# EAGLE design 4-SSR (EAGLE 7.7.0)
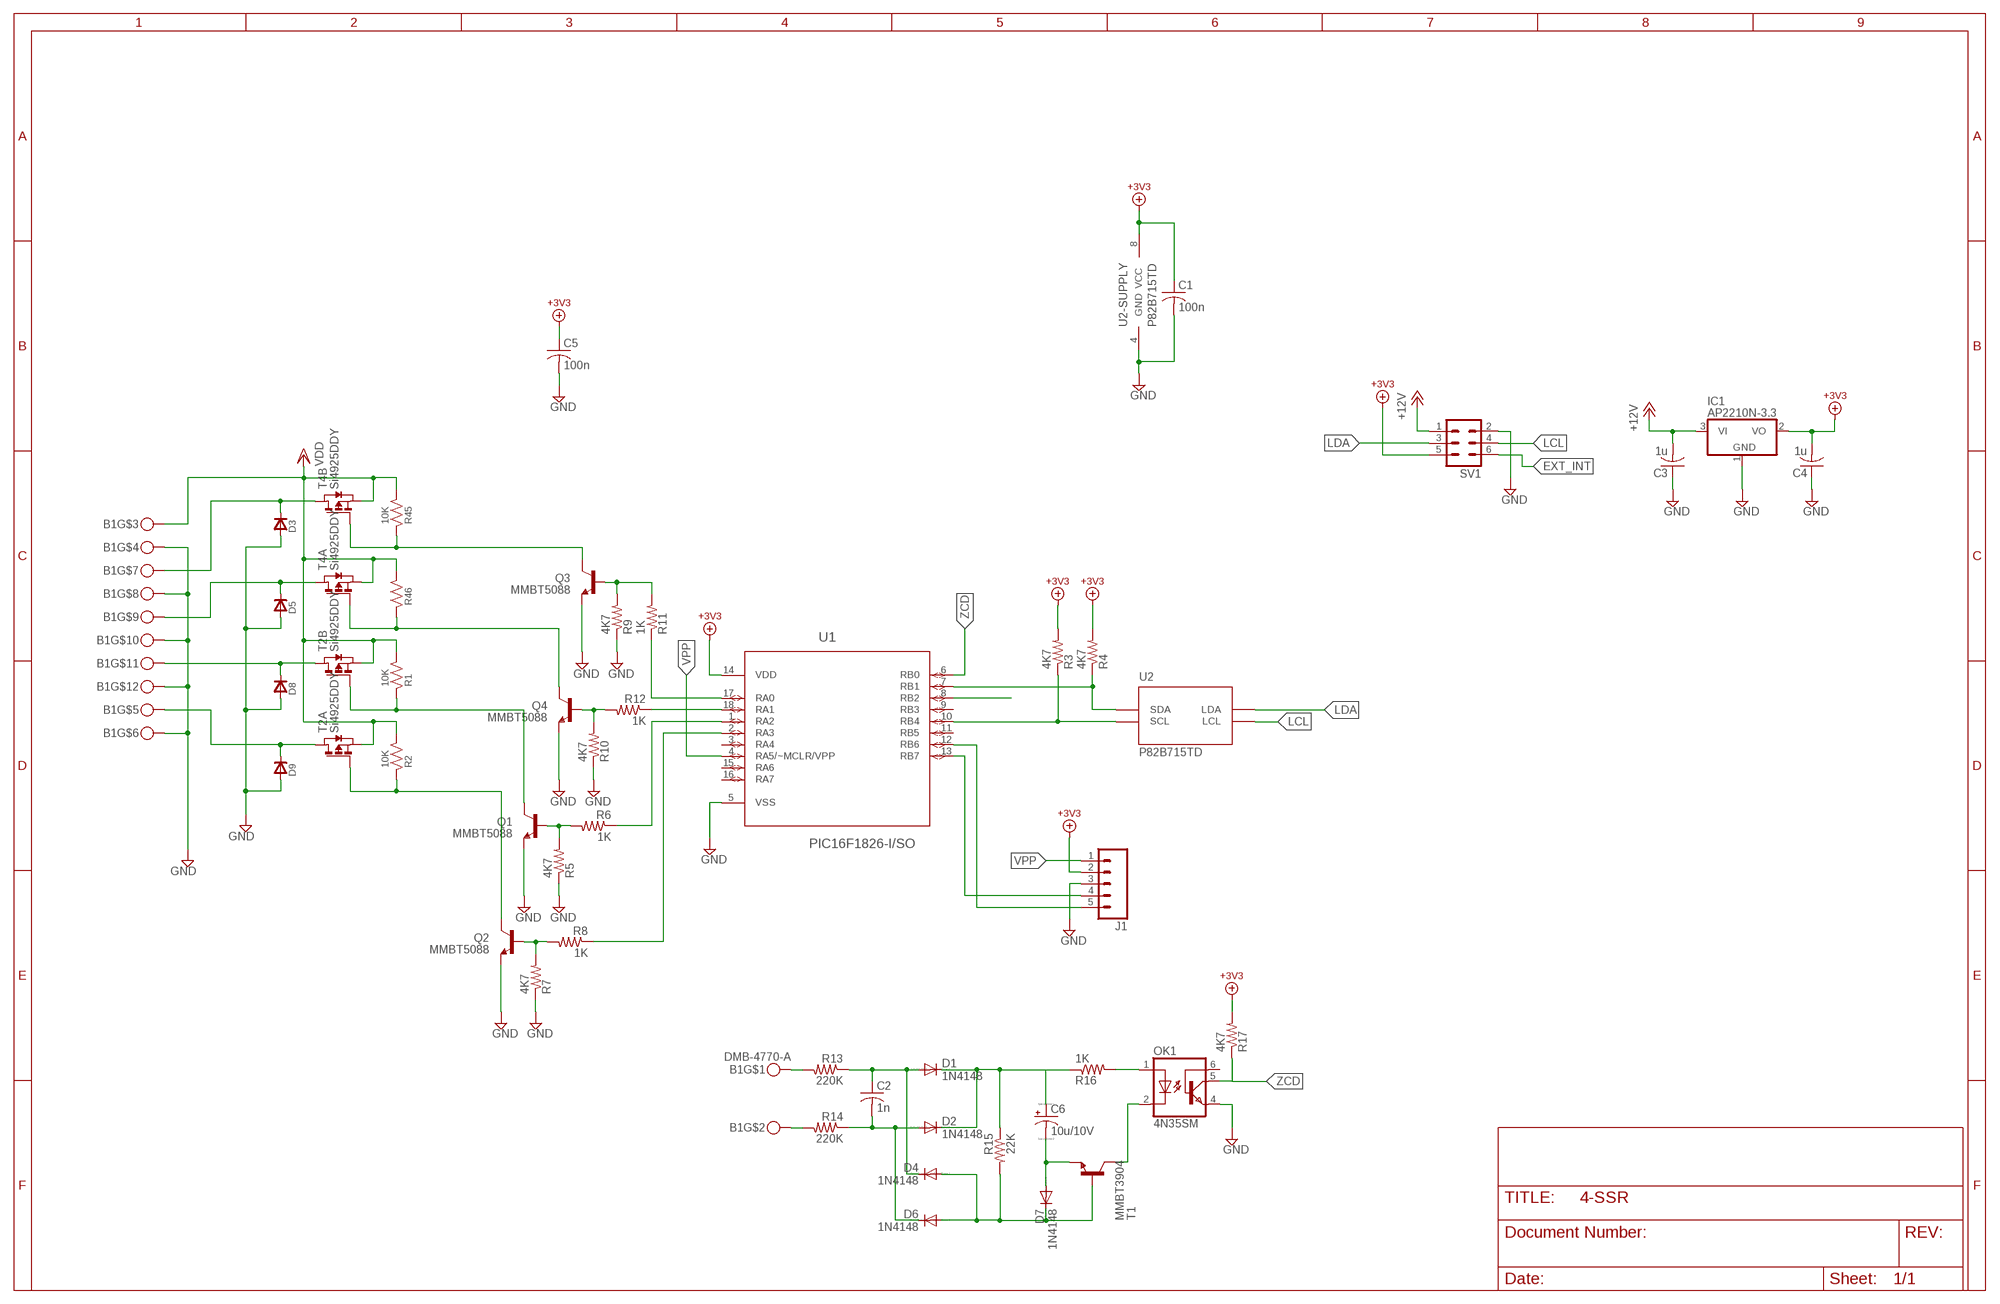
[diagram p0: schematic, sheet 1]

## Parts
B1  DMB-4770-A  [DMB-4770-A-PKG]
C1  100n  C-USC0805  [C0805]
C2  1n  C-USC1808  [C1808]
C3  1u  C-USC0805  [C0805]
C4  1u  C-USC0805  [C0805]
C5  100n  C-USC0805  [C0805]
C6  10u/10V  CPOL-USB  [PANASONIC_B]
D1  1N4148  DIODE-SOD80C  [SOD80C]
D2  1N4148  DIODE-SOD80C  [SOD80C]
D3  DSMA  [DSMA]
D4  1N4148  DIODE-SOD80C  [SOD80C]
D5  DSMA  [DSMA]
D6  1N4148  DIODE-SOD80C  [SOD80C]
D7  1N4148  DIODE-SOD80C  [SOD80C]
D8  DSMA  [DSMA]
D9  DSMA  [DSMA]
IC1  AP2210N-3.3  MCP1703CB  [SOT23]
J1  M05PTH  [1X05]
OK1  4N35SM  [DIL6-SMD]
Q1  MMBT5088  TRANSISTOR_NPNMMBT5088  [SOT23-3]
Q2  MMBT5088  TRANSISTOR_NPNMMBT5088  [SOT23-3]
Q3  MMBT5088  TRANSISTOR_NPNMMBT5088  [SOT23-3]
Q4  MMBT5088  TRANSISTOR_NPNMMBT5088  [SOT23-3]
R1  10K  RU0805  [R0805]
R2  10K  RU0805  [R0805]
R3  4K7  R-US_R0805  [R0805]
R4  4K7  R-US_R0805  [R0805]
R5  4K7  R-US_R0805  [R0805]
R6  1K  R-US_R0805  [R0805]
R7  4K7  R-US_R0805  [R0805]
R8  1K  R-US_R0805  [R0805]
R9  4K7  R-US_R0805  [R0805]
R10  4K7  R-US_R0805  [R0805]
R11  1K  R-US_R0805  [R0805]
R12  1K  R-US_R0805  [R0805]
R13  220K  R-US_R0805  [R0805]
R14  220K  R-US_R0805  [R0805]
R15  22K  R-US_R0805  [R0805]
R16  1K  R-US_R0805  [R0805]
R17  4K7  R-US_R0805  [R0805]
R45  10K  RU0805  [R0805]
R46  RU0805  [R0805]
SV1  ML6  [ML6]
T1  MMBT3904  MMBT3904LT1-NPN-SOT23-BEC  [SOT23-BEC]
T2  Si4925DDY  PMOS2SO8  [SO8]
T4  Si4925DDY  PMOS2SO8  [SO8]
U1  PIC16F1826-I/SO  [SOIC127P1030X175-18N]
U2  P82B715TD  [SOIC-8]

## Nets
+3V3: C1.1 C4.2 C5.1 IC1.2(VO) J1.2 R3.2 R4.2 R17.2 SV1.5 U1.14(VDD) U2.8(VCC) ; supply symbol labelled V+3V3
+12VBUS: C3.2 IC1.3(VI) SV1.1 ; supply symbol labelled +12V
EXT_INT: SV1.6
GND: B1.P$4 B1.P$6 B1.P$8 B1.P$10 B1.P$12 C1.2 C3.1 C4.1 C5.2 D3.A D5.A D8.A D9.A IC1.1(GND) J1.3 OK1.4(EMI) Q1.2(E) Q2.2(E) Q3.2(E) Q4.2(E) R5.1 R7.1 R9.1 R10.1 SV1.2 U1.5(VSS) U2.4(GND)
LCL: SV1.4 U2.2(LCL)
LDA: SV1.3 U2.7(LDA)
N$1: Q1.3(C) R1.1 T2.4(B:G)
N$2: B1.P$11 D8.C T2.5(B:D) T2.6(B:D)
N$3: Q2.3(C) R2.1 T2.2(A:G)
N$4: B1.P$5 D9.C T2.7(A:D) T2.8(A:D)
N$5: J1.4 U1.13(RB7)
N$6: J1.5 U1.12(RB6)
N$7: R12.1 U1.18(RA1)
N$9: U1.8(RB2)
N$10: Q4.3(C) R46.1 T4.2(A:G)
N$11: Q3.1(B) R9.2 R11.2
N$12: R11.1 U1.17(RA0)
N$13: Q1.1(B) R5.2 R6.2
N$14: Q4.1(B) R10.2 R12.2
N$15: B1.P$1 R13.2
N$16: B1.P$2 R14.2
N$17: C2.1 D1.A D4.C R13.1
N$18: C2.2 D2.A D6.C R14.1
N$19: C6.+ D1.C D2.C R15.1 R16.1
N$20: C6.- D7.A T1.E
N$21: OK1.1(A) R16.2
N$22: D4.A D6.A D7.C R15.2 T1.B
N$23: OK1.2(C) T1.C
N$24: R6.1 U1.1(RA2)
N$26: Q2.1(B) R7.2 R8.2
N$27: R8.1 U1.2(RA3)
N$41: R3.1 U1.10(RB4) U2.3(SCL)
N$42: R4.1 U1.7(RB1) U2.6(SDA)
N$80: Q3.3(C) R45.1 T4.4(B:G)
N$95: B1.P$7 D3.C T4.5(B:D) T4.6(B:D)
N$96: B1.P$9 D5.C T4.7(A:D) T4.8(A:D)
VDD: B1.P$3 R1.2 R2.2 R45.2 R46.2 T2.1(A:S) T2.3(B:S) T4.1(A:S) T4.3(B:S)
VPP: J1.1 U1.4(RA5/~MCLR/VPP)
ZCD: OK1.5(COL) R17.1 U1.6(RB0)
Unconnected: OK1.6(BAS) U1.3(RA4) U1.9(RB3) U1.11(RB5) U1.15(RA6) U1.16(RA7)

## Library data of the parts
B1 = Cedric:DMB-4770-A
C1-C5 = resistor:C-US: CAPACITOR, American symbol
C6 = resistor:CPOL-US: POLARIZED CAPACITOR, American symbol
D1 D2 D4 D6 D7 = diode:DIODE-: DIODE
D3 D5 D8 D9 = diodes:D: Diode
IC1 = linear:MCP1703: 250 mA, 16V, Low Quiescent Current LDO Regulator Source: http://ww1.microchip.com/downloads/en/DeviceDoc/22049b.pdf
J1 = SparkFun-Connectors:M05: Header 5 Standard 5-pin 0.1" header. Use with straight break away headers (SKU : PRT-00116), right angle break away headers (PRT-00553), swiss pins (PRT-00743), machine pins (PRT-00117), and female headers (PRT-00115). Molex polarized connector foot print use with SKU : PRT-08230 with associated crimp pins and housings.
OK1 = optocoupler:4N*?M: General Purpose 6-Pin Phototransistor Optocouplers Source: http://www.fairchildsemi.com/ds/4N/4N35-M.pdf; MF: FAIRCHILD SEMICONDUCTOR; MPN: 4N35S-M; OC_FARNELL: 1021179; OC_NEWARK: 67K2285
Q1-Q4 = SparkFun-DiscreteSemi:TRANSISTOR_NPN: Generic NPN BJT MMBT2222A - TRANS-08049 (SOT-23, 1A 40V) MPSA42 - TRANS-09116 (SOT-23, 500mA 300V) MMBT5088LT1G - TRANS-11160 (SOT-23, 50 mA 30V) BC547 - COM-08928 <http://www.sparkfun.com/products/8928> (TO-92 45V 100mA) (1.Collector 2.Base 3.Emitter) 2N3904 - COM-00521 <http://www.sparkfun.com/products/521> (TO-92 40V 200mA) (1.Emitter 2.Base 3.Collector) P2N2222A - COM-12852 <http://www.sparkfun.com/products/12852> (TO-92 40V 600mA) (1.Collector 2.Base 3.Emitter); PROD_ID: TRANS-11160
R1 R2 R45 R46 = divers:RU: Resistor, US symbol
R3-R12 R17 = resistor:R-US_: RESISTOR, American symbol
R13-R16 = rcl:R-US_: RESISTOR, American symbol
SV1 = con-harting-ml:ML6: HARTING; OC_FARNELL: unknown; OC_NEWARK: unknown
T1 = transistor:*-NPN-: NPN Transistror BF959 corrected 2008.03.06
T2 T4 = zetex:PMOS2: DUAL 30V P-CHANNEL ENHANCEMENT MODE MOSFET Source: Data sheet <http://www.diodes.com/datasheets/ZXMP3A16DN8.pdf> SOP8 Source: Data sheet <http://www.diodes.com/datasheets/ZXMD63P03X.pdf> MSOP8; OC_FARNELL: unknown; OC_NEWARK: unknown
U1 = Microchip_By_element14_Batch_1:PIC16F1826-I/SO: Flash Microcontrollers; DESCRIPTION: Flash Microcontrollers; MPN: PIC16F1826-I/SO; OC_FARNELL: 1778443; OC_NEWARK: 24R7065; PACKAGE: SOIC-18; SUPPLIER: Microchip Technology
U2 = Volks73-NXPSemiconductors:P82B715?: I2C-Bus Extender I2C-bus extender Documentation Datasheet <http://www.nxp.com/documents/data_sheet/P82B715.pdf> General Description The P82B715 is a bipolar IC intended for application in I2C-bus and derivative bus systems. While retaining all the operating modes and features of the I2C-bus it permits extension of the practical separation distance between components on the I2C-bus by buffering both the data (SDA) and the clock (SCL) lines. The I2C-bus capacitance limit of 400 pF restricts practical communication distances to a few meters. Using one P82B715 at each end of a long cable (connecting Lx/Ly to Lx/Ly) reduces that cable’s loading on the linked I2C-buses by a factor of 10 and allows the total system capacitance load (all devices, cable, connectors, and traces or wires connected to the I2C-bus) to be around 3000 pF while the loading on each I2C-bus on the Sx/Sy sides remains below 400 pF. Longer cables or low-cost, general-purpose wiring may be used to link I2C-bus based modules without degrading noise margins. Multiple P82B715s can be connected together, linking their Lx/Ly ports, in a star or multi-point architecture as long as the total capacitance of the system is less than about 3000 pF and each bus at an Sx/Sy connection is well below 400 pF. This configuration, with the master and/or slave devices attached to the Sx/Sy port of each P82B715, has full multi-master communication capability. The P82B715 alone does not support voltage level translation, but it can be simply implemented using low cost transistors when required. There is no restriction on interconnecting the Sx/Sy I/Os, and, because the device output levels are always held within 100 mV of input drive levels, P82B715 is compatible with bus buffers that use voltage level offsets, e.g., PCA9511A, PCA9517, Sx/Sy side of P82B96. The lower VOL level and ability to operate with any master, slave or bus buffer is the primary advantage of the using the P82B715 for long distance buses at the disadvantage of not isolating bus capacitance like the P82B96 or PCA9600 are able to do. The primary disadvantage of the P82B96 and PCA9600 is that the static level offset needed to isolate bus capacitance does not allow these devices to operate with other bus buffers with special offset levels or with master/slaves that require a VIL lower than 0.8 V with noise margin. A proven quick design-in point-to-point/multi-point circuit (Figure 9) is included in Section 8.2 to allow rapid use of the P82B715 along with comparison waveforms so that the designer can clearly see the trade-offs between the P82B715 and the P82B96/PCA9600 and choose the type of device that is best for their application. Features Dual, bidirectional, unity voltage gain buffer with no external directional control required Compatible with I2C-bus and its derivatives SMBus, PMBus, DDC, etc. Logic signal levels may include (but not exceed) both supply and ground Logic signal input voltage levels are output without change and are independent of VCC ×10 impedance transformation, but does not change logic voltage levels Supply voltage range 3 V to 12 V Clock speeds to at least 100 kHz and 400 kHz when other system delays permit ESD protection exceeds 2500 V HBM per Mil. Std 883C-3015.7 and 400 V MM per JESD22-A115 (I/Os have diodes to VCC and GND) Latch-up testing is done to JEDEC Standard JESD78 which exceeds 100 mA Applications Increase the total connected capacitance of an I2C-bus system to around 3000 pF Drive I2C-bus signals over long cables to approximately 50 meters or 3000 pF Drives ×10 lower impedance bus wiring for improved noise immunity Multi-drop distribution of I2C-bus signals using low cost twisted-pair cables AdvancedTCA radial IPMB architecture Driving 30 mA Fm+ devices from standard 3 mA parts; APPLICATIONS: I2C; CAPACITANCE-INPUT: 3000pF; CURRENT_SUPPLY: 22mA; DATA_RATE: 400kHz; DELAY_TIME: -; DESCRIPTION: IC REDRIVER I2C 1CH 400KHZ 8SO; DOCUMENTATION_LINK: <a href="http://www.nxp.com/documents/data_sheet/P82B715.pdf">Datasheet</a>; DOCUMENTATION_URL: http://www.nxp.com/documents/data_sheet/P82B715.pdf; INPUT: 2-Wire Buse; MANUFACTURER: NXP Semiconductors; NUMBER_OF_CHANNELS: 1; OPERATING_TEMPERATURE: -40C ~ 85C; OUTPUT: 2-Wire Bus; PART_NUMBER: P82B715TD,118; SIGNAL_CONDITIONING: -; SUPPLIER_ITEM_LINK: <a href="http://www.digikey.com/product-detail/en/P82B715TD,118/568-1007-2-ND/735621">Details</a>; SUPPLIER_ITEM_NUMBER: 568-1007-2-ND; SUPPLIER_ITEM_URL: http://www.digikey.com/product-detail/en/P82B715TD,118/568-1007-2-ND/735621; SUPPLIER_LINK: <a href="http://www.digikey.com">Home Page</a>; SUPPLIER_NAME: Digi-Key; SUPPLIER_URL: http://www.digikey.com; TYPE: Buffer, ReDriver; VOLTAGE_SUPPLY: 4.5V ~ 12V

## Board
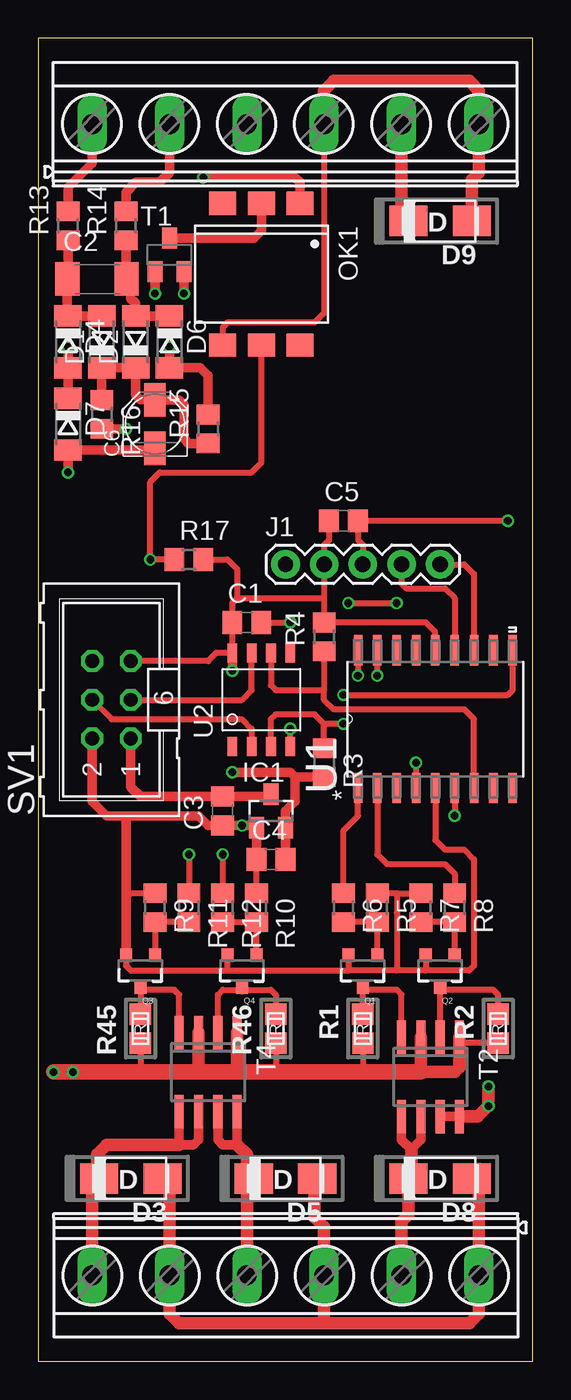
[diagram p1: board, top side]
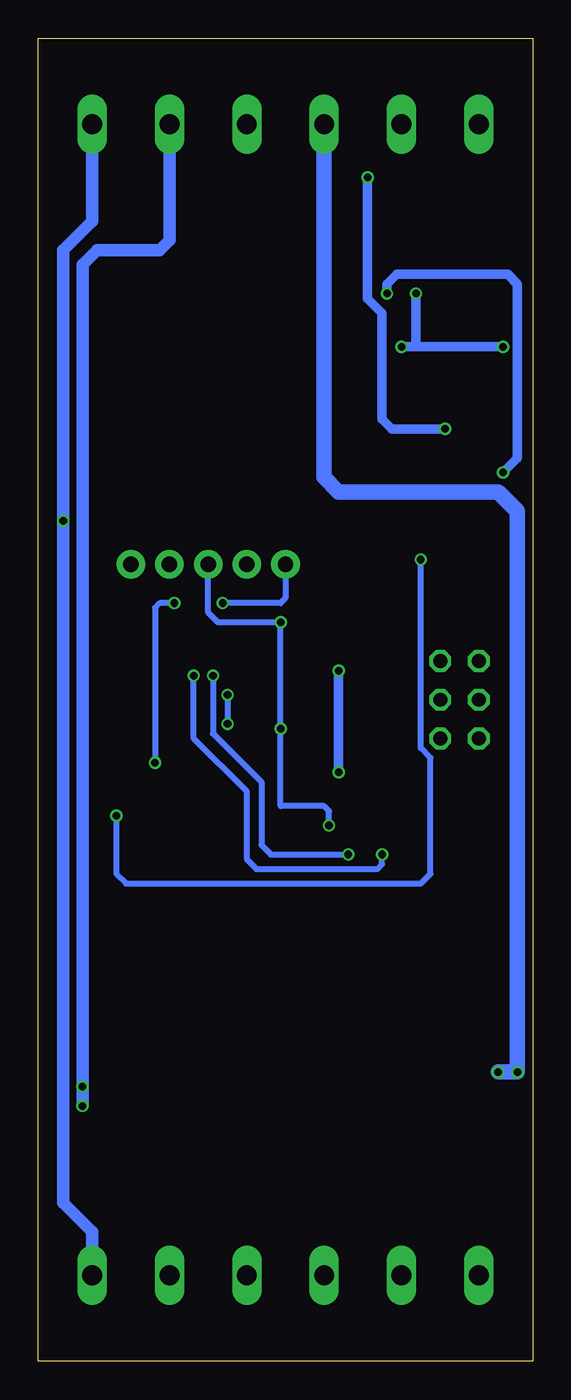
[diagram p2: board, bottom side, seen from below]

Size 32.51 x 86.89 mm. Coordinates in mm from the lower left corner, seen from the top.
Copper layers (1*16): Top 0.035mm / dielectric 1.5mm / Bottom 0.035mm
Design rules "ITEADstudio_DRC": minimum track width 6mil, minimum drill 12mil, track to track 6mil, track to pad 6mil, pad to pad 6mil, via to via 6mil, smd to smd 0mil, copper to edge 10mil, drill to drill 10mil, minimum pad ring 10mil, minimum via ring 6mil, stop-mask expansion 2mil, vias tented up to drill 100mil, thermal gap 10mil

### Footprints (pad centres in the part's own frame; a part is rotated, then mirrored left to right if it is on the bottom)
DMB-4770-A-PKG = drill 1.3 long: P$1 -12.7,37.795; P$2 -7.62,37.795; P$3 -2.54,37.795; P$4 2.54,37.795; P$5 7.62,37.795; P$6 12.7,37.795; P$7 -12.7,-37.795; P$8 -7.62,-37.795; P$9 -2.54,-37.795; P$10 2.54,-37.795; P$11 7.62,-37.795; P$12 12.7,-37.795
C0805 = smd 1.3 x 1.5: 1 -0.95,0; 2 0.95,0
C1808 = smd 1.6 x 2.2: 1 -1.95,0; 2 1.95,0
PANASONIC_B = smd 2.2 x 1.4: + 1.6,0; - -1.6,0
SOD80C = smd 1.4 x 1.8: A 1.7,0; C -1.7,0
DSMA = smd 2.5 x 2: A -2.083,0; C 2.083,0
SOT23 = smd 1 x 1.4: 1 -0.95,-1.1; 2 0.95,-1.1; 3 0,1.1
1X05 = drill 1.016 pad 1.88: 1 0,0; 2 2.54,0; 3 5.08,0; 4 7.62,0; 5 10.16,0
DIL6-SMD = smd 1.78 x 1.52: 1 -2.54,-4.645; 2 0,-4.645; 3 2.54,-4.645; 4 2.54,4.645; 5 0,4.645; 6 -2.54,4.645
SOT23-3 = smd 0.8 x 0.9: 1 -0.95,-1; 2 0.95,-1; 3 0,1.1
R0805 = smd 1.397 x 1.397: 1 -0.953,0; 2 0.953,0
R0805' = smd 1.3 x 1.5: 1 -0.95,0; 2 0.95,0
ML6 = drill 0.914 octagon: 1 -2.54,-1.27; 2 -2.54,1.27; 3 0,-1.27; 4 0,1.27; 5 2.54,-1.27; 6 2.54,1.27
SOT23-BEC = smd 1 x 1.4: B -0.95,-1.1; C 0,1.1; E 0.95,-1.1
SO8 = smd 0.6 x 2.2: 1 -1.905,-2.6; 2 -0.635,-2.6; 3 0.635,-2.6; 4 1.905,-2.6; 5 1.905,2.6; 6 0.635,2.6; 7 -0.635,2.6; 8 -1.905,2.6
SOIC127P1030X175-18N = smd 1.981 x 0.559: 1 -4.521,5.08; 2 -4.521,3.81; 3 -4.521,2.54; 4 -4.521,1.27; 5 -4.521,0; 6 -4.521,-1.27; 7 -4.521,-2.54; 8 -4.521,-3.81; 9 -4.521,-5.08; 10 4.521,-5.08; 11 4.521,-3.81; 12 4.521,-2.54; 13 4.521,-1.27; 14 4.521,0; 15 4.521,1.27; 16 4.521,2.54; 17 4.521,3.81; 18 4.521,5.08
SOIC-8 = smd 1.27 x 0.635: 1 -3.073,1.905; 2 -3.073,0.635; 3 -3.073,-0.635; 4 -3.073,-1.905; 5 3.073,-1.905; 6 3.073,-0.635; 7 3.073,0.635; 8 3.073,1.905

### Placement (x,y rotation side)
B1  16.26,43.45 0 top
C1  13.72,48.53 0 top
C2  3.87,71.07 0 top
C3  12.13,36.14 90 top
C4  15.3,32.97 0 top
C5  20.07,55.19 0 top
C6  7.68,61.54 90 top
D1  4.19,66.94 90 top
D2  6.41,66.94 90 top
D3  6.1,12.01 180 top
D4  1.97,66.94 270 top
D5  16.26,12.01 180 top
D6  8.64,66.94 270 top
D7  1.97,61.54 270 top
D8  26.42,12.01 180 top
D9  26.42,74.88 180 top
IC1  15.3,36.14 0 top
J1  16.26,52.34 0 top
OK1  14.67,71.39 180 top
Q1  21.34,25.67 180 top
Q2  26.42,25.67 180 top
Q3  6.73,25.67 180 top
Q4  13.4,25.67 180 top
R1  21.34,21.86 270 top
R2  30.23,21.86 270 top
R3  4K7  [R0805']  18.8,39.32 270 top
R4  4K7  [R0805']  18.8,47.57 90 top
R5  4K7  [R0805']  22.29,29.79 270 top
R6  1K  [R0805']  20.07,29.79 270 top
R7  4K7  [R0805']  25.15,29.79 270 top
R8  1K  [R0805']  27.37,29.79 270 top
R9  4K7  [R0805']  7.68,29.79 270 top
R10  4K7  [R0805']  14.35,29.79 270 top
R11  1K  [R0805']  9.91,29.79 270 top
R12  1K  [R0805']  12.13,29.79 270 top
R13  220K  [R0805']  1.97,74.56 90 top
R14  220K  [R0805']  5.78,74.56 90 top
R15  22K  [R0805']  11.18,61.23 90 top
R16  1K  [R0805']  4.19,62.18 270 top
R17  4K7  [R0805']  9.91,52.65 0 top
R45  6.73,21.86 270 top
R46  15.62,21.86 270 top
SV1  4.83,43.45 90 top
T1  8.64,72.66 0 top
T2  25.78,18.68 180 top
T4  11.18,19 180 top
U1  26.1,42.18 90 top
U2  14.67,43.45 90 top

### Tracks (layer width: path | path; a pad name or v marks a point on that pad's centre or on a via)
+3V3  (via drill 0.5)
  Top 0.406: SV1.5 11.18,45.99 11.71,46.52 U2.8 C1.1 12.77,49.8 13.08,50.11 | 13.08,50.11 18.8,50.11 | 18.8,50.11 R4.2 25.46,48.53 26.1,47.89 U1.14 | R17.2 12.45,52.65 13.08,52.02 13.08,50.11 | 18.8,50.11 J1.2 18.8,53.61 19.12,53.93 C5.1
  Top 0.61: C4.2 IC1.2 16.25,36.14 16.89,36.78 16.89,38.05 16.89,38.37 | R3.2 16.89,38.37 | 16.89,38.37 16.57,38.68 v12.76,38.68 | v12.76,45.35 U2.8
  Bottom 0.61: v12.76,38.68 v12.76,45.35
+12VBUS
  Top 0.406: 13.08,37.1 C3.2 | 15.15,37.09 IC1.3
  Top 0.61: SV1.1 6.1,37.73 6.73,37.1 13.08,37.1 | C3.2 15.15,37.09
GND  (via drill 0.5)
  Top 0.406: C3.1 13.08,35.19 12.76,35.19 | 14.2,35.19 IC1.1 | C1.2 v16.57,48.53 | U2.4 v16.57,41.54 | 13.72,35.19 v13.4,35.19 | 12.45,25.67 Q4.2 | R9.1 6.1,30.74 5.78,30.43 | R10.1 14.35,32.65 14.67,32.97 C4.1 | 12.45,25.67 20.38,25.67 | B1.P$4 18.8,68.85 18.16,68.21 12.45,68.21 12.13,67.89 OK1.4 | Q1.2 20.39,25.67 20.38,25.67 | Q2.2 25.47,25.67 25.46,25.67 | 25.46,25.67 23.56,25.67 | 23.56,25.67 20.38,25.67 | 23.56,30.74 R7.1 | U1.5 26.1,34.24 26.73,33.6 28,33.6 28.64,32.97 28.64,25.98 28.32,25.67 25.46,25.67 | 23.56,30.74 23.56,29.48 23.56,25.67 | 23.56,30.74 R5.1 | 5.78,26.62 5.78,25.98 6.1,25.67 12.45,25.67 | J1.3 21.34,53.61 21.02,53.93 C5.2 v30.86,55.19
  Top 0.61: SV1.2 3.56,36.78 4.51,35.83 5.78,35.83 | 5.78,35.83 10.54,35.83 11.18,35.19 13.08,35.19 | C3.1 12.76,35.19 v13.4,35.19 14.2,35.19 | IC1.1 C4.1 | 5.78,35.83 5.78,35.82 5.78,30.43 Q3.2 5.78,26.62
  Top 0.813: D3.A 8.64,11.87 B1.P$8 8.64,3.12 9.27,2.49 18.8,2.49 | D5.A 18.16,12.19 18.16,9.47 18.8,8.84 B1.P$10 18.8,2.49 | D8.A 28.82,12.51 28.96,12.65 B1.P$12 28.96,3.12 28.32,2.49 18.8,2.49 | B1.P$4 18.8,83.45 19.43,84.09 28.32,84.09 28.96,83.45 B1.P$6 28.96,78.05 28.5,77.6 D9.A
  Bottom 0.406: v13.4,35.19 13.4,36.14 13.72,36.46 16.57,36.46 v16.57,41.54 v16.57,48.53 20.7,48.53 21.34,49.16 J1.3
  Bottom 0.813: B1.P$6 28.96,74.88 30.86,72.97 v30.86,55.19 30.86,10.43 28.96,8.52 B1.P$12
LCL
  Top 0.406: SV1.4 4.83,42.18 13.4,42.18 14.03,41.54 U2.2
LDA
  Top 0.406: SV1.3 13.4,43.45 14.03,44.08 U2.7
N$1
  Top 0.406: R1.1 Q1.3 | Q1.3 | T2.4 23.88,24.08 23.56,24.4 21.51,24.4 Q1.3
N$2
  Top 0.61: T2.6 25.15,14.55 24.51,13.92 23.88,14.55 T2.5 | 24.51,12.47 D8.C
  Top 0.813: 24.51,13.92 24.51,12.47 | D8.C 24.33,9.61 23.88,9.16 B1.P$11
N$3
  Top 0.406: T2.2 Q2.3 26.59,24.4 29.91,24.4 30.23,24.08 R2.1
N$4  (via drill 0.5)
  Top 0.61: T2.7 T2.8
  Top 0.813: T2.8 28.9,16.08 v29.59,16.78 v29.59,18.05 | D9.C 24.02,75.37 23.88,75.51 B1.P$5
  Bottom 0.813: v29.59,16.78 v29.59,18.05 29.59,72.02 28.64,72.97 24.51,72.97 23.88,73.61 B1.P$5
N$5
  Top 0.406: J1.4 23.88,51.07 24.19,50.75 26.73,50.75 27.37,50.11 U1.13
N$6
  Top 0.406: J1.5 28,52.34 28.64,51.7 U1.12
N$7  (via drill 0.5)
  Top 0.406: U1.18 v21.02,45.03 | v12.13,33.29 R12.1
  Bottom 0.406: v21.02,45.03 21.02,41.22 17.84,38.05 17.84,33.92 17.21,33.29 v12.13,33.29
N$10
  Top 0.406: R46.1 15.62,24.08 15.3,24.4 13.4,24.4 12.13,24.4 11.81,24.08 T4.2
  Top 0.61: R46.1 | Q4.3 13.4,24.4
N$11
  Top 0.406: R11.2 R9.2 7.68,26.99 Q3.1
N$12  (via drill 0.5)
  Top 0.406: v9.91,33.29 R11.1 | v22.29,45.03 U1.17
  Bottom 0.406: v9.91,33.29 9.91,32.65 10.22,32.33 18.16,32.33 18.8,32.97 18.8,37.41 22.29,40.91 v22.29,45.03
N$13
  Top 0.406: Q1.1 R5.2 R6.2
N$14
  Top 0.406: Q4.1 R10.2 R12.2
N$15
  Top 0.61: R13.2 1.97,77.1 3.56,78.69 B1.P$1
N$16
  Top 0.61: R14.2 5.78,76.78 6.41,77.42 8,77.42 8.64,78.05 B1.P$2
N$17
  Top 0.61: R13.1 1.97,71.11 C2.1 1.92,68.69 D4.C D1.A
N$18
  Top 0.61: R14.1 5.78,71.11 C2.2 6.1,70.8 6.1,69.8 6.41,69.48 D2.A D6.C
N$19
  Top 0.61: R16.1 D1.C D2.C 6.41,63.45 6.72,63.14 C6.+ 7.7,63.13 9.27,63.13 9.59,62.81 9.59,60.59 9.9,60.28 R15.1
N$20  (via drill 0.5)
  Top 0.61: T1.E 9.59,71.39 v9.59,70.12 | v1.97,58.37 D7.A 7.58,59.84 C6.-
  Bottom 0.61: v9.59,70.12 9.59,70.75 8.95,71.39 1.65,71.39 1.02,70.75 1.02,59.32 v1.97,58.37
N$21  (via drill 0.5)
  Top 0.61: R16.2 v5.78,61.23 | v10.86,77.74 16.89,77.74 17.21,77.42 OK1.1
  Bottom 0.61: v5.78,61.23 9.27,61.23 9.91,61.86 9.91,68.85 10.86,69.8 v10.86,77.74
N$22  (via drill 0.5)
  Top 0.61: D7.C D4.A v1.97,66.62 | v8.64,66.62 D6.A 10.65,65.24 11.18,64.72 R15.2 | T1.B 7.69,71.7 7.68,71.7 v7.68,70.12
  Bottom 0.61: v1.97,66.62 7.68,66.62 | 7.68,66.62 v8.64,66.62 | v7.68,70.12 7.68,66.62
N$23
  Top 0.61: T1.C 14.18,73.76 14.67,74.24 OK1.2
N$24
  Top 0.406: R6.1 20.07,34.87 21.02,35.83 U1.1
N$26
  Top 0.406: Q2.1 R8.2 R7.2
N$27
  Top 0.406: U1.2 22.29,33.29 22.92,32.65 26.73,32.65 27.37,32.02 R8.1
N$41  (via drill 0.5)
  Top 0.406: U2.3 15.3,42.18 15.62,42.49 18.16,42.49 18.8,41.86 | R3.1 18.8,41.86 | v20.07,41.86 18.8,41.86 | v20.07,43.76 30.86,43.76 31.18,44.08 U1.10
  Bottom 0.406: v20.07,43.76 v20.07,41.86
N$42
  Top 0.406: U2.6 15.3,44.4 15.62,44.08 18.8,44.08 | 18.8,44.08 R4.1 | 18.8,44.08 18.8,43.45 19.43,42.81 28,42.81 28.64,42.18 U1.7
N$80
  Top 0.406: R45.1 Q3.3 6.9,24.4 8.95,24.4 9.27,24.08 T4.4
  Top 0.61: R45.1
N$95
  Top 0.61: T4.6 10.54,14.55 10.22,14.24 9.27,14.24 T4.5
  Top 0.813: B1.P$7 3.56,11.87 D3.C | 9.27,14.24 4.51,14.24 3.87,13.6 3.87,12.15
  Top 1.016: 3.87,12.15 D3.C
N$96
  Top 0.61: T4.8 13.08,14.24 12.13,14.24 11.81,14.55 T4.7
  Top 0.813: B1.P$9 13.72,12.19 D5.C 13.72,12.47 13.72,13.6 13.08,14.24
VDD  (via drill 0.5)
  Top 0.406: R45.2 6.73,19 | R46.2 15.62,19 | R2.2 28.06,20.9 T2.1 | R1.2 21.34,19
  Top 0.813: T4.1 13.08,19 | T4.3 10.54,19 | T2.3 25.15,19.32 24.83,19 | T2.1 27.69,19.32 27.37,19 25.15,19
  Top 1.016: v1.02,19 v2.29,19 6.73,19 10.54,19 13.08,19 15.62,19 21.34,19 24.83,19 25.15,19
  Bottom 1.016: B1.P$3 13.72,58.05 12.76,57.1 2.29,57.1 1.02,55.83 v1.02,19 v2.29,19
VPP  (via drill 0.5)
  Top 0.406: v20.38,49.8 v23.56,49.8 | v24.83,39.32 U1.4
  Bottom 0.406: J1.1 16.26,50.11 16.57,49.8 v20.38,49.8 | v23.56,49.8 24.51,49.8 24.83,49.48 v24.83,39.32
ZCD  (via drill 0.5)
  Top 0.406: U1.6 v27.37,35.83 | OK1.5 14.67,59 14.03,58.37 8,58.37 7.37,57.73 v7.37,52.65 R17.1
  Bottom 0.406: v27.37,35.83 27.37,32.02 26.73,31.38 7.37,31.38 6.73,32.02 6.73,39.64 7.37,40.27 v7.37,52.65